# Altium project PCB_PROJECT1.PRJPCB
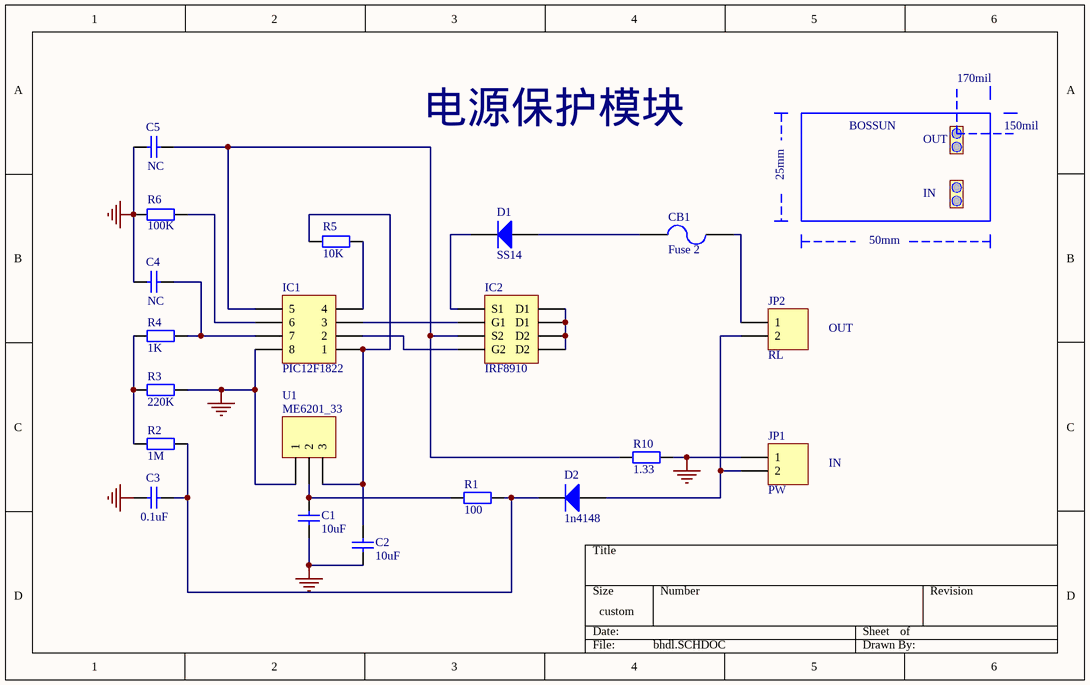
[diagram p0: bhdl.SCHDOC]
2 sheets, 40 parts. Net scope: global (net labels, ports and power ports of the same name join across sheets).
Board files: PCB1.PcbDoc, PCB2.PcbDoc
Sheets:
  bhdl.SCHDOC
  Sheet1.SchDoc

## Sheet bhdl.SCHDOC
size 203 x 127 mm

### Parts
(Parts that share a designator on the sheet are numbered #1, #2 ... from top to bottom, then left to right.)
C1#1  value 10uF  [0805]  (hidden comment: Cap)
C2#1  value 10uF  [0805]  (hidden comment: Cap)
C3#1  value 0.1uF  [0805]  (hidden comment: Cap)
C4#1  value NC  [0805]  (hidden comment: Cap)
C5#1  value NC  [0805]  (hidden comment: Cap)
CB1#1  Fuse 2  [AXIAL0.4]
D1#1  SS14  [1210]
D2#1  1n4148  [1210]
IC1#1  PIC12F1822  [so-8]
IC2#1  IRF8910  [so-8]
JP1#1  PW  [sip2]
JP2#1  RL  [sip2]
R1#1  value 100  [0805]  (hidden comment: Res2)
R2#1  value 1M  [0805]  (hidden comment: Res2)
R3#1  value 220K  [0805]  (hidden comment: Res2)
R4#1  value 1K  [0805]  (hidden comment: Res2)
R5#1  value 10K  [0805]  (hidden comment: Res2)
R6#1  100K  [0805]
R10#1  value 1.33  [AXIAL0.5]  (hidden comment: Res2)
U1#1  ME6201_33  [SOT-89]

### Nets
GND: C1#1.1 C2#1.1 C3#1.1 C4#1.1 C5#1.1 IC1#1.8 JP1#1.1 R3#1.2 R6#1.1 R10#1.2 U1#1.1
NetC1#1_2: C1#1.2 R1#1.1 U1#1.2
NetC2#1_2: C2#1.2 IC1#1.1 R5#1.1 U1#1.3
NetC3#1_2: C3#1.2 D2#1.2(K) R1#1.2 R2#1.2
NetC4#1_2: C4#1.2 IC1#1.7 R4#1.2
NetC5#1_2: C5#1.2 IC1#1.5 IC2#1.3(S2) R10#1.1
NetCB1#1_1: CB1#1.1 D1#1.1(A)
NetCB1#1_2: CB1#1.2 JP2#1.1
NetD1#1_2: D1#1.2(K) IC2#1.1(S1)
NetD2#1_1: D2#1.1(A) JP1#1.2 JP2#1.2
NetIC1#1_2: IC1#1.2 IC2#1.4(G2)
NetIC1#1_3: IC1#1.3 IC2#1.2(G1)
NetIC1#1_4: IC1#1.4 R5#1.2
NetIC1#1_6: IC1#1.6 R6#1.2
NetIC2#1_5: IC2#1.5(D2) IC2#1.6(D2) IC2#1.7(D1) IC2#1.8(D1)
NetR2#1_1: R2#1.1 R3#1.1 R4#1.1

### Notes on the sheet
- 170mil
- 电源保护模块
- BOSSUN
- OUT
- 150mil
- 25mm
- IN
- 50mm

### Library data of the parts
C1#1 C2#1 C3#1 C4#1 C5#1 = Cap: Capacitor; Published: 8-Jun-2000; Revision: July-2002: Re-released for DXP Platform.; Publisher: Altium Limited
CB1#1 = Fuse 2: Fuse; Published: 8-Jun-2000; Revision: July-2002: Re-released for DXP Platform.; Publisher: Altium Limited
D1#1 D2#1 = Diode 1N4007: 1 Amp General Purpose Rectifier; Revision 1: 11-Jul-2000: SIM Model Added.; Revision 2: 17-Jul-2002: Re-released for DXP Platform.; Package Information: Latest Revision: Aug-1999; Code - JEDEC: DO-204-AL; Published: 8-Jun-2000; Datasheet: Latest Revision: 1998; Package Reference: DO-41; Publisher: Altium Limited
IC1#1 IC2#1 = Header 4X2A: Header, 4-Pin, Dual row; Revision: 17-Jul-2002: Re-released for DXP Platform.; Publisher: Altium Limited
JP1#1 JP2#1 = Header 2: Header, 2-Pin; Revision: 17-Jul-2002: Re-released for DXP Platform.; Publisher: Altium Limited
R1#1 R2#1 R3#1 R4#1 R5#1 R10#1 = Res2: Resistor; Published: 8-Jun-2000; Revision: July-2002: Re-released for DXP Platform.; Publisher: Altium Limited
R6#1 = Res2: Resistor; Value: 1K; Published: 8-Jun-2000; Revision: July-2002: Re-released for DXP Platform.; Publisher: Altium Limited
U1#1 = Header 3: Header, 3-Pin; Revision: 17-Jul-2002: Re-released for DXP Platform.; Publisher: Altium Limited

## Sheet Sheet1.SchDoc
size A4
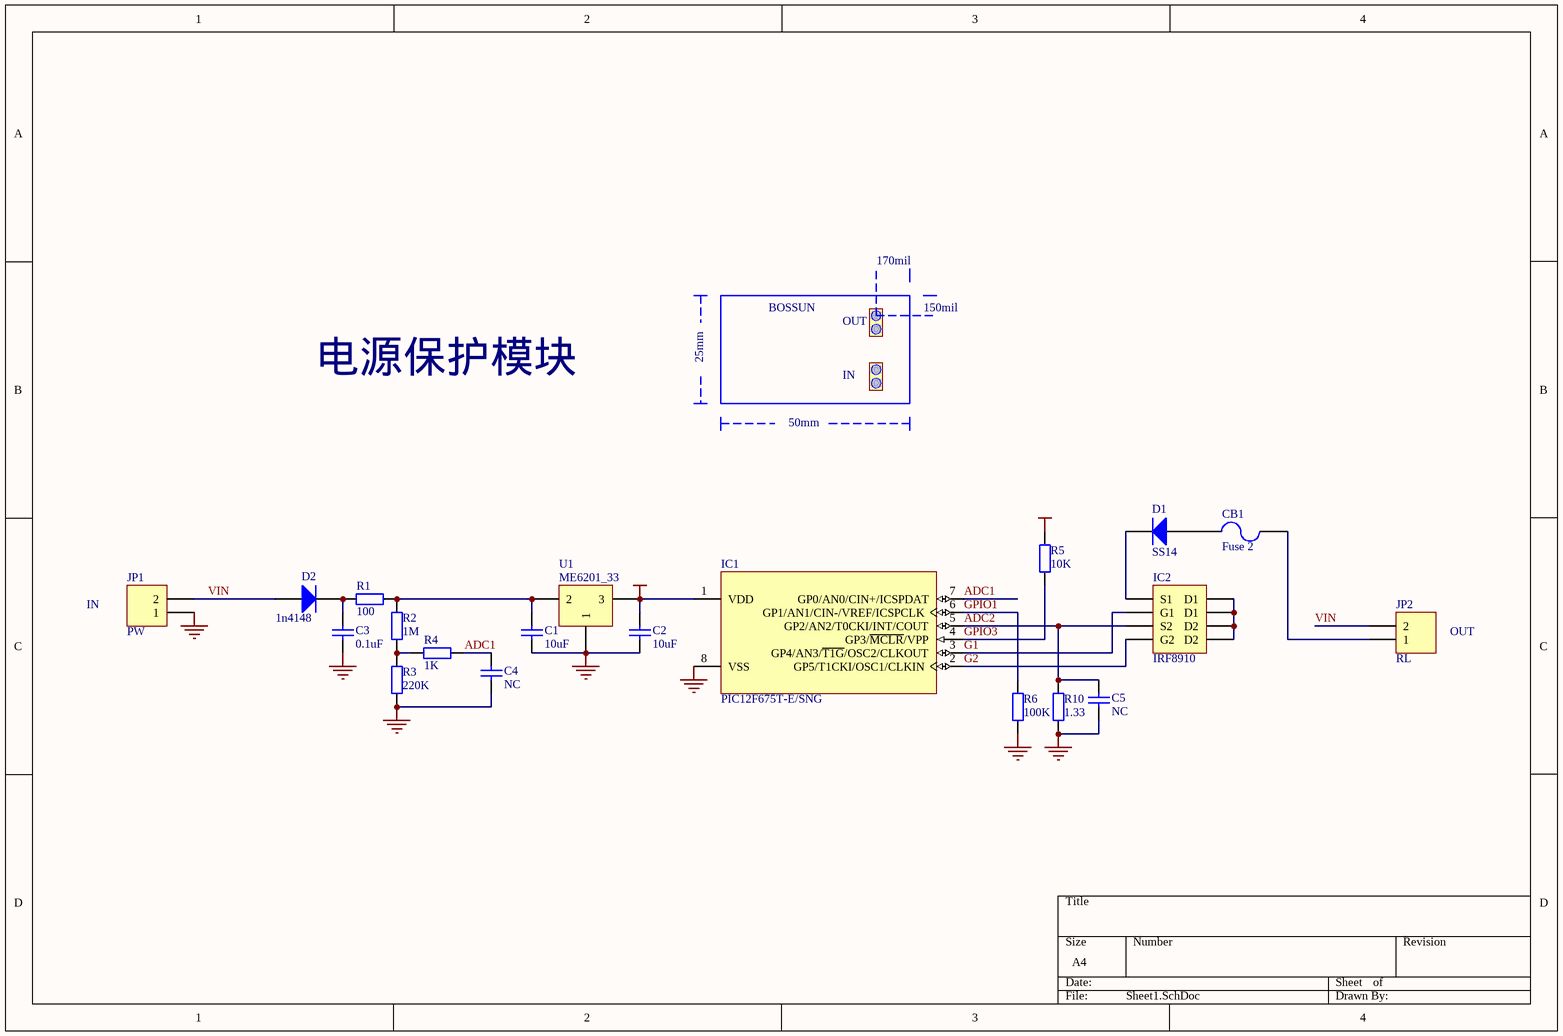
[diagram p1: Sheet1.SchDoc]

### Parts
(Parts that share a designator on the sheet are numbered #1, #2 ... from top to bottom, then left to right.)
C1#2  value 10uF  [0805]  (hidden comment: Cap)
C2#2  value 10uF  [0805]  (hidden comment: Cap)
C3#2  value 0.1uF  [0805]  (hidden comment: Cap)
C4#2  value NC  [0805]  (hidden comment: Cap)
C5#2  value NC  [0805]  (hidden comment: Cap)
CB1#2  Fuse 2  [AXIAL0.4]
D1#2  SS14  [1210]
D2#2  1n4148  [1210]
IC1#2  PIC12F675T-E/SNG  [SOIC150-8]
IC2#2  IRF8910  [so-8]
JP1#2  PW  [sip2]
JP2#2  RL  [sip2]
R1#2  value 100  [0805]  (hidden comment: Res2)
R2#2  value 1M  [0805]  (hidden comment: Res2)
R3#2  value 220K  [0805]  (hidden comment: Res2)
R4#2  value 1K  [0805]  (hidden comment: Res2)
R5#2  value 10K  [0805]  (hidden comment: Res2)
R6#2  100K  [0805]
R10#2  value 1.33  [AXIAL0.5]  (hidden comment: Res2)
U1#2  ME6201_33  [SOT-89]

### Nets
GND: C1#2.1 C2#2.1 C3#2.1 C4#2.1 C5#2.1 IC1#2.8(VSS) JP1#2.1 R3#2.1 R6#2.1 R10#2.1 U1#2.1
VCC: C2#2.2 IC1#2.1(VDD) R5#2.2 U1#2.3
ADC1: C4#2.2 IC1#2.7(GP0/AN0/CIN+/ICSPDAT) R4#2.2
ADC2: C5#2.2 IC1#2.5(GP2/AN2/T0CKI/INT/COUT) IC2#2.3(S2) R10#2.2
G1: IC1#2.3(GP4/AN3/~{T1G}/OSC2/CLKOUT) IC2#2.2(G1)
G2: IC1#2.2(GP5/T1CKI/OSC1/CLKIN) IC2#2.4(G2)
GPIO1: IC1#2.6(GP1/AN1/CIN-/VREF/ICSPCLK) R6#2.2
GPIO3: IC1#2.4(GP3/~{MCLR}/VPP) R5#2.1
VIN: D2#2.1(A) JP1#2.2 JP2#2.2
NetC1#2_2: C1#2.2 R1#2.2 R2#2.2 U1#2.2
NetC3#2_2: C3#2.2 D2#2.2(K) R1#2.1
NetCB1#2_1: CB1#2.1 D1#2.1(A)
NetCB1#2_2: CB1#2.2 JP2#2.1
NetD1#2_2: D1#2.2(K) IC2#2.1(S1)
NetIC2#2_5: IC2#2.5(D2) IC2#2.6(D2) IC2#2.7(D1) IC2#2.8(D1)
NetR2#2_1: R2#2.1 R3#2.2 R4#2.1

### Notes on the sheet
- BOSSUN
- 170mil
- 150mil
- 电源保护模块
- 25mm
- IN
- OUT
- 50mm

### Library data of the parts
C1#2 C2#2 C3#2 C4#2 C5#2 = Cap: Capacitor; Published: 8-Jun-2000; Revision: July-2002: Re-released for DXP Platform.; Publisher: Altium Limited
CB1#2 = Fuse 2: Fuse; Published: 8-Jun-2000; Revision: July-2002: Re-released for DXP Platform.; Publisher: Altium Limited
D1#2 D2#2 = Diode 1N4007: as D1#1 on sheet bhdl; Published: 8-Jun-2000; Datasheet: Latest Revision: 1998; Package Reference: DO-41; Publisher: Altium Limited
IC1#2 = PIC12F675T-E/SNG: FLASH-Based 8-Bit CMOS Microcontroller, 10-Bit A/D, 8-Pin SOIC 150mil Lead-Free, Extended Temperature, Tape and Reel; PackageDocument: DS00049W_2003; Note: Refer to data sheet (DS41190C) for details of supply voltage range under different conditions.; Published: 11-Oct-2004; DatasheetDocument: DS41190C_2003; PackageReference: SOIC150-8; Publisher: Altium Limited; Code_JEDEC: MS-012
IC2#2 = Header 4X2A: Header, 4-Pin, Dual row; Revision: 17-Jul-2002: Re-released for DXP Platform.; Publisher: Altium Limited
JP1#2 JP2#2 = Header 2: Header, 2-Pin; Revision: 17-Jul-2002: Re-released for DXP Platform.; Publisher: Altium Limited
R1#2 R2#2 R3#2 R4#2 R5#2 R10#2 = Res2: Resistor; Published: 8-Jun-2000; Revision: July-2002: Re-released for DXP Platform.; Publisher: Altium Limited
R6#2 = Res2: Resistor; Value: 1K; Published: 8-Jun-2000; Revision: July-2002: Re-released for DXP Platform.; Publisher: Altium Limited
U1#2 = Header 3: Header, 3-Pin; Revision: 17-Jul-2002: Re-released for DXP Platform.; Publisher: Altium Limited

## Nets that join several sheets
GND: bhdl (11 pins), Sheet1 (11 pins)